# Altium project Guppy Buddy Rev A.PrjPCB (part 7 of 7)

## Sheet 5V Regulator.SchDoc: 5V Regulator
size Tabloid; Date: 1/20/2016; ApprovedBy: NA; CompanyName: Cospan Design LLC; DrawnBy: David McCoy; Engineer: David McCoy; DocumentNumber: 16; Revision: A; SheetNumber: 16; SheetTotal: 18; Client: OSH; ProjectPrettyName: Guppy Buddy; Project: Guppy Buddy; ProjectName: Edenis: TX Adapter
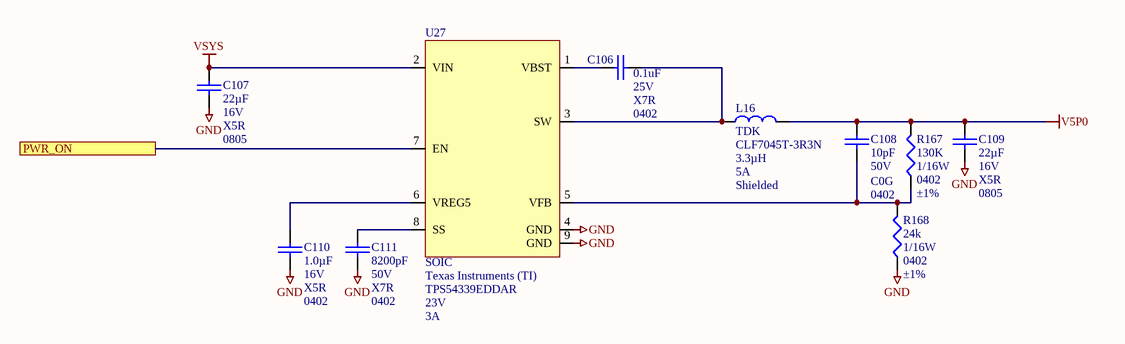
[diagram p14: 5V Regulator.SchDoc]

### Parts
C106  Capacitance: 0.1uF  Voltage - Rated: 25V  Temperature Coefficient: X7R  Package / Case: 0402  [C_0402]  (hidden comment: C_0402_0.1UF_25V)
C107  Voltage - Rated: 16V  Temperature Coefficient: X5R  Package / Case: 0805  [C_0805]  (hidden comment: 22µF)
C108  Voltage - Rated: 50V  Temperature Coefficient: C0G  Package / Case: 0402  [C_0402]  (hidden comment: 10pF)
C109  Voltage - Rated: 16V  Temperature Coefficient: X5R  Package / Case: 0805  [C_0805]  (hidden comment: 22µF)
C110  Capacitance: 1.0µF  Voltage - Rated: 16V  Temperature Coefficient: X5R  Package / Case: 0402  [C_0402]  (hidden comment: 1.0uF)
C111  Capacitance: 8200pF  Voltage - Rated: 50V  Temperature Coefficient: X7R  Package / Case: 0402  [C_ERA-0402]  (hidden comment: C_0402_8.2NF)
L16  Manufacturer: TDK  Manufacturer Part Number: CLF7045T-3R3N  Inductance: 3.3µH  Current Rating: 5A  Shielding: Shielded  [CLF7045]  (hidden comment: L_CLF7045T-3R3N)
R167  Resistance In Ohms: 130K  Power (Watts): 1/16W  Case: 0402  Tolerance: ±1%  [R_0402]  (hidden comment: R_0402_130K)
R168  Resistance In Ohms: 24k  Power (Watts): 1/16W  Case: 0402  Tolerance: ±1%  [R_0402]  (hidden comment: R_0402_24k)
U27  Case/Package: SOIC  Manufacturer: Texas Instruments (TI)  Manufacturer Part Number: TPS54339EDDAR  Max Input Voltage: 23V  Output Current: 3A  [DDA0008E]  (hidden comment: U_TPS54339EDDAR)

### Ports
PWR_ON

### Nets
GND: C107.1 C109.1 C110.1 C111.1 R168.2 U27.4(GND) U27.9(GND)
V5P0: C108.2 C109.2 L16.1 R167.1
VSYS: C107.2 U27.2(VIN)
PWR_ON: U27.7(EN) ; port PWR_ON
NetC106_1: C106.1 L16.2 U27.3(SW)
NetC106_2: C106.2 U27.1(VBST)
NetC108_1: C108.1 R167.2 R168.1 U27.5(VFB)
NetC110_2: C110.2 U27.6(VREG5)
NetC111_2: C111.2 U27.8(SS)

### Notes on the sheet
- Project:
- http://www.cospandesign.com
- Cospan Design
- Document:
- Engineer:
- Title:
- Client:
- Approved By:
- Revision:
- Date:
- Number:
- of

### Library data of the parts
C106 = C_0402_0.1UF_25V: CAP CER 0.1UF 25V X6S 0402; Manufacturer 1: Yageo; Manufacturer Part Number 1: CC0402KRX7R8BB104; Description 1: Cap Ceramic 0.1uF 25V X7R 10% SMD 0402 125C Paper T/R; Tolerance: 10%; Dissipation Factor: 3.5%; ComponentLink1URL: https://product.tdk.com/info/en/catalog/datasheets/mlcc_commercial_general_en.pdf; ComponentLink1Description: https://product.tdk.com/info/en/catalog/datasheets/mlcc_commercial_general_en.pdf; Supplier 1: Digi-Key; Supplier Part Number 1: 311-2077-1-ND; Stock 1: 0; Pricing 1: 1=0.1, 10=0.048, 100=0.0215, 500=0.01534, 1000=0.01205, 2500=0.01095, 5000=0.01007 (USD); Mount: Surface Mount; Case/Package: 0402; Case Code (Imperial): 0402; Case Code (Metric): 1005; Min Operating Temperature: -55°C; Max Operating Temperature: 125°C; Voltage Rating: 25V; Voltage Rating (DC): 25V; Packaging: Tape and Reel; Dielectric: X7R; Termination: SMD/SMT; Composition: Ceramic; Length: 1mm; Height: 0.5mm; Width: 0.02inch; Thickness: 0.022inch; Depth: 0.5mm; Radiation Hardening: No; Lead Free: Lead Free; Halogen Free: Halogen Free; ComponentLink2URL: https://datasheet.ciiva.com/11464/upy-gphc-x7r-6-3v-to-50v-8-11464889.pdf; ComponentLink2Description: https://datasheet.ciiva.com/11464/upy-gphc-x7r-6-3v-to-50v-8-11464889.pdf; ComponentLink3URL: https://datasheet.ciiva.com/13210/upy-gphc-x7r-6-3v-to-50v-8-12304-13210908.pdf; ComponentLink3Description: https://datasheet.ciiva.com/13210/upy-gphc-x7r-6-3v-to-50v-8-12304-13210908.pdf; ComponentLink4URL: https://datasheet.ciiva.com/17437/upy-gphc-x7r-6-3v-to-50v-8-17437357.pdf; ComponentLink4Description: https://datasheet.ciiva.com/17437/upy-gphc-x7r-6-3v-to-50v-8-17437357.pdf
C107 C109 = C_0805_22µF_16V: CAP CER 22UF 16V 10% X5R 0805; Manufacturer 1: Samsung; Manufacturer Part Number 1: CL21A226MOCLRNC; Description 1: 22µF 16V Ceramic Capacitor X5R 0805 (2012 Metric) 0.079" L x 0.049" W (2.00mm x 1.25mm); Tolerance: 20%; ComponentLink1URL: http://product.tdk.com/capacitor/mlcc/en/documents/mlcc_commercial_general_en.pdf; ComponentLink1Description: http://product.tdk.com/capacitor/mlcc/en/documents/mlcc_commercial_general_en.pdf; Supplier 1: Digi-Key; Supplier Part Number 1: 1276-6780-6-ND; Stock 1: 40000; Pricing 1: 1=0.33, 10=0.227, 100=0.1288, 500=0.09094, 1000=0.07956 (USD); Mount: Surface Mount; Case/Package: 0805; Case Code (Metric): 2012; Case Code (Imperial): 0805; Min Operating Temperature: -55°C; Max Operating Temperature: 85°C; Packaging: Tape and Reel; Voltage Rating: 16V; Length: 0.079inch; Width: 0.049inch; Thickness: 0.037inch; ComponentLink2URL: http://www.samsungsem.com/kr/support/product-search/mlcc/CL21A226MOCLRNC.jsp; ComponentLink2Description: http://www.samsungsem.com/kr/support/product-search/mlcc/CL21A226MOCLRNC.jsp; Capacitance: 22µF
C108 = C_0402_10PF_50V: CAP CER 10PF 50V NP0 0402; Manufacturer: Taiyo Yuden; Manufacturer Part Number: UMK105CG100DV-F; Tolerance: .5pF; Supplier 1: Digi-Key; Supplier Part Number 1: 587-1947-1-ND; RoHS: RoHS Compliant; Category: Capacitors; Stock 1: 47289; Pricing: 1=0.07, 10=0.045, 50=0.0216, 100=0.0162, 250=0.01172, 500=0.00864, 1000=0.00585, 5000=0.0045 (USD); Mounting Type: Surface Mount, MLCC; Operating Temperature: -55°C ~ 125°C; Applications: General Purpose; Ratings: -; Size / Dimension: 0.039" L x 0.020" W (1.00mm x 0.50mm); Height - Seated (Max): -; Thickness (Max): 0.022" (0.55mm); Lead Spacing: -; Features: -; Packaging: Cut Tape (CT); Lead Style: -; ComponentLink1URL: http://www.yuden.co.jp/productdata/catalog/en/mlcc02_e.pdf; ComponentLink1Description: http://www.yuden.co.jp/productdata/catalog/en/mlcc02_e.pdf; Capacitance: 10pF
C110 = C_0402_1.0UF_16V: CAP CER 1.0UF 16V X5R 0402; Manufacturer 1: Samsung; Manufacturer Part Number 1: CL05A105KO5NNNC; Tolerance: 10%; Description 1: Cap Ceramic 1uF 16V X5R 10% SMD 0402 85C Paper T/R; Supplier 1: Digi-Key; Stock 1: 26908; Pricing 1: 1=0.1, 10=0.062, 100=0.0276, 500=0.01968, 1000=0.01547, 2500=0.01406, 5000=0.01294 (USD); Packaging: Tape and Reel; ComponentLink1URL: http://ds.yuden.co.jp/TYCOMPAS/ut/detail.do?productNo=EMK105BJ105KV-F&fileName=EMK105BJ105KV-F_SS&mode=specSheetDownload; ComponentLink1Description: http://ds.yuden.co.jp/TYCOMPAS/ut/detail.do?productNo=EMK105BJ105KV-F&fileName=EMK105BJ105KV-F_SS&mode=specSheetDownload; Supplier Part Number 1: 1276-1067-6-ND; ComponentLink2URL: https://datasheet.ciiva.com/16207/cl05a105ko5nnnc-16207571.pdf; ComponentLink2Description: https://datasheet.ciiva.com/16207/cl05a105ko5nnnc-16207571.pdf; ComponentLink3URL: https://datasheet.ciiva.com/15195/getdatasheetpartid-355272-15195629.pdf; ComponentLink3Description: https://datasheet.ciiva.com/15195/getdatasheetpartid-355272-15195629.pdf; Mount: Surface Mount; Case/Package: 0402; Case Code (Metric): 1005; Case Code (Imperial): 0402; Contact Plating: Tin; Min Operating Temperature: -55°C; Max Operating Temperature: 85°C; Dielectric: X5R; Package Quantity: 1; Voltage Rating: 16V; Voltage: 16V; Length: 1mm; Height: 0.5mm; Width: 0.02inch; Thickness: 0.022inch; Depth: 0.5mm; Radiation Hardening: No
C111 = C_0402_8.2NF: CAP CER 8200PF 50V X7R 0402; Manufacturer 1: Samsung; Manufacturer Part Number 1: CL05B822KB5NNNC; Tolerance: 10%; Description 1: Cap Ceramic 0.0082uF 50V X7R 10% SMD 0402 125C T/R; Material: Ceramic; Supplier 1: Digi-Key; Stock 1: 102323; Pricing 1: 1=0.1, 10=0.037, 100=0.0164, 500=0.01168, 1000=0.00918, 2500=0.00834, 5000=0.00768 (USD); Packaging: Tape and Reel; ComponentLink1URL: http://www.murata.com/~/media/webrenewal/support/library/catalog/products/capacitor/mlcc/c02e.ashx; ComponentLink1Description: http://www.murata.com/~/media/webrenewal/support/library/catalog/products/capacitor/mlcc/c02e.ashx; Supplier Part Number 1: 1276-1591-6-ND; Mount: Surface Mount; Case/Package: 0402; Case Code (Metric): 1005; Case Code (Imperial): 0402; Min Operating Temperature: -55°C; Max Operating Temperature: 125°C; Package Quantity: 1; Voltage Rating: 50V; Dielectric: X7R; Voltage: 50V; Voltage Rating (DC): 50V; Length: 1mm; Height: 0.5mm; Width: 0.02inch; Thickness: 0.022inch; Depth: 0.5mm; Radiation Hardening: No; Lead Free: Lead Free; ComponentLink2URL: https://datasheet.ciiva.com/16207/cl05b104kq5nnnc-16207576.pdf; ComponentLink2Description: https://datasheet.ciiva.com/16207/cl05b104kq5nnnc-16207576.pdf; ComponentLink3URL: https://datasheet.ciiva.com/15195/getdatasheetpartid-464695-15195658.pdf; ComponentLink3Description: https://datasheet.ciiva.com/15195/getdatasheetpartid-464695-15195658.pdf; ComponentLink4URL: https://datasheet.ciiva.com/29198/458804-da-01-en-vs-kondensator-0402-29198438.pdf; ComponentLink4Description: https://datasheet.ciiva.com/29198/458804-da-01-en-vs-kondensator-0402-29198438.pdf
L16 = L_CLF7045T-3R3N: FIXED IND 15UH 1.9A 95.8 MOHM; Type: Wirewound; Material - Core: Ferrite; Tolerance: ±30%; DC Resistance (DCR): 21.32 mOhm Max; Supplier 1: Digi-Key; RoHS: RoHS Compliant; Category: Inductors, Coils, Chokes; Stock 1: 4747; Pricing 1: 1=1.43, 10=1.332, 100=0.9632, 500=0.73774 (USD); Packaging: Cut Tape (CT); Part Status: Active; Q @ Freq: -; Ratings: AEC-Q200; Operating Temperature: -40°C ~ 150°C; Mounting Type: Surface Mount; Package / Case: Nonstandard; Size / Dimension: 0.283" L x 0.272" W (7.20mm x 6.90mm); Height - Seated (Max): 0.177" (4.50mm); ComponentLink1URL: https://product.tdk.com/info/en/documents/catalog/inductor_automotive_power_clf7045-d_en.pdf; ComponentLink1Description: https://product.tdk.com/info/en/documents/catalog/inductor_automotive_power_clf7045-d_en.pdf; Supplier Part Number 1: 445-9554-1-ND
R167 = R_0402_130K: RES 130K OHM 1/10W 1% 0402 SMD; Manufacturer: Panasonic Electronic Components; Manufacturer Part Number: ERJ-2RKF1303X; Temperature Coefficient: ±100ppm/°C; Supplier 1: Digi-Key; Supplier Part Number 1: P130KLCT-ND; RoHS: RoHS Compliant; Category: Resistors; Stock 1: 388696; Pricing: 1=0.1, 50=0.0242, 100=0.0184, 250=0.01364, 500=0.01008, 1000=0.00672, 5000=0.00473 (USD); Resistance (Ohms): 130k; Composition: Thick Film; Features: -; Package / Case: 0402 (1005 Metric); Supplier Device Package: 0402; Size / Dimension: 0.039" L x 0.020" W (1.00mm x 0.50mm); Height: 0.016" (0.40mm); Number of Terminations: 2; Packaging: Cut Tape (CT); ComponentLink1URL: http://industrial.panasonic.com/www-cgi/jvcr13pz.cgi?E+PZ+3+AOA0002+ERJ2RKF1303X+7+WW; ComponentLink1Description: http://industrial.panasonic.com/www-cgi/jvcr13pz.cgi?E+PZ+3+AOA0002+ERJ2RKF1303X+7+WW
R168 = R_0402_24k: RES SMD 24K OHM 1% 1/16W 0402; Manufacturer: Yageo; Manufacturer Part Number: RC0402FR-0724KL; Temperature Coefficient: ±100ppm/°C; Supplier 1: Digi-Key; RoHS: RoHS Compliant; Category: Resistors; Stock 1: 267958; Pricing 1: 1=0.1, 10=0.014, 100=0.0056, 1000=0.00253, 2500=0.0022, 5000=0.00181 (USD); Packaging: Cut Tape (CT); Part Status: Active; Resistance (Ohms): 24k; Composition: Thick Film; Features: Moisture Resistant; Operating Temperature: -55°C ~ 155°C; Package / Case: 0402 (1005 Metric); Supplier Device Package: 0402; Size / Dimension: 0.039" L x 0.020" W (1.00mm x 0.50mm); Height - Seated (Max): 0.016" (0.40mm); Failure Rate: -; ComponentLink1URL: http://www.yageo.com/documents/recent/PYu-RC_Group_51_RoHS_L_7.pdf; ComponentLink1Description: http://www.yageo.com/documents/recent/PYu-RC_Group_51_RoHS_L_7.pdf; Supplier Part Number 1: 311-24KLRCT-ND
U27 = U_TPS54339EDDAR: IC REG BUCK SYNC ADJ 3A 8SOPWR; Min Supply Voltage: 4.5V; Number of Outputs: 1; Output Voltage: 7V; Max Output Current: 10A; Switching Frequency: 600KHz; Min Output Voltage: 760mV; Synchronous Rectifier: Yes; Quiescent Current: 600uA; Supplier 1: Digikey; Stock 1: 1978; Pricing 1: 1=1.91, 10=1.72, 100=1.3822, 500=1.1356, 1000=0.9409 (USD); Mount: Surface Mount; Number of Pins: 8; Contact Plating: Gold; Min Operating Temperature: -40°C; Max Operating Temperature: 85°C; Min Input Voltage: 4.5V; Package Quantity: 2500; Packaging: Tape and Reel; Max Output Voltage: 7V; Lead Free: Lead Free; ComponentLink1URL: http://www.ti.com/litv/slvsbm0a; ComponentLink1Description: http://www.ti.com/litv/slvsbm0a; ComponentLink2URL: http://www.ti.com/general/docs/lit/getliterature.tsp?genericPartNumber=TPS54339E&&fileType=pdf; ComponentLink2Description: http://www.ti.com/general/docs/lit/getliterature.tsp?genericPartNumber=TPS54339E&&fileType=pdf; ComponentLink3URL: http://www.ti.com/lit/ds/symlink/tps54339e.pdf; ComponentLink3Description: http://www.ti.com/lit/ds/symlink/tps54339e.pdf; Supplier Part Number 1: 296-40793-1-ND

## Sheet Low Speed Expansion.SchDoc: Low Speed Expansion
size Tabloid; ApprovedBy: NA; CompanyName: Cospan Design LLC; DrawnBy: David McCoy; Engineer: David McCoy; DocumentNumber: 9; Revision: A; SheetNumber: 9; SheetTotal: 18; Client: OSH; Project: Guppy Buddy; ProjectPrettyName: Guppy Buddy
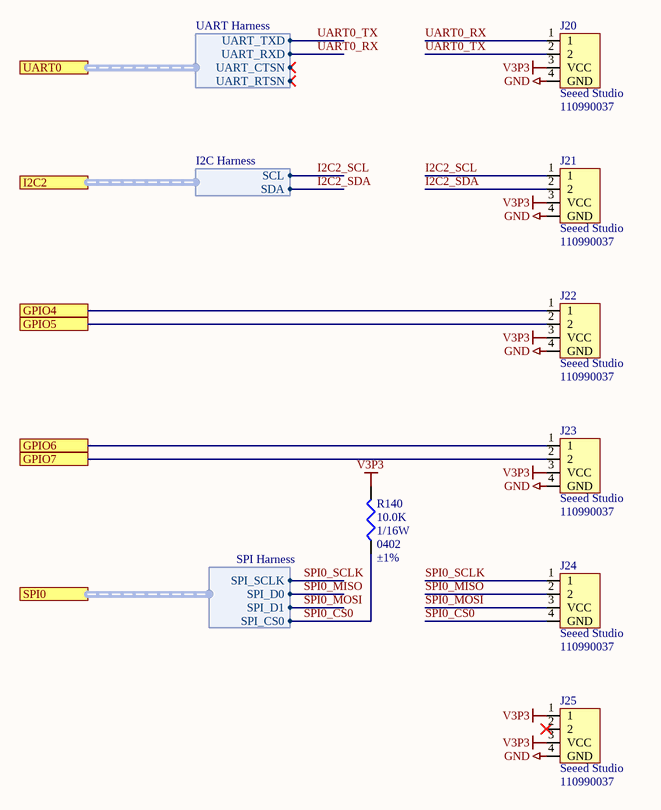
[diagram p15: Low Speed Expansion.SchDoc]

### Parts
J20  Manufacturer 1: Seeed Studio  Manufacturer Part Number 1: 110990037  [HW4-2.0-90D]  (hidden comment: 320110034)
J21  Manufacturer 1: Seeed Studio  Manufacturer Part Number 1: 110990037  [HW4-2.0-90D]  (hidden comment: 320110034)
J22  Manufacturer 1: Seeed Studio  Manufacturer Part Number 1: 110990037  [HW4-2.0-90D]  (hidden comment: 320110034)
J23  Manufacturer 1: Seeed Studio  Manufacturer Part Number 1: 110990037  [HW4-2.0-90D]  (hidden comment: 320110034)
J24  Manufacturer 1: Seeed Studio  Manufacturer Part Number 1: 110990037  [HW4-2.0-90D]  (hidden comment: 320110034)
J25  Manufacturer 1: Seeed Studio  Manufacturer Part Number 1: 110990037  [HW4-2.0-90D]  (hidden comment: 320110034)
R140  Resistance In Ohms: 10.0K  Power (Watts): 1/16W  Case: 0402  Tolerance: ±1%  [R_0402]  (hidden comment: R_0402_10.0K)

### Ports
GPIO4, GPIO5, GPIO6, GPIO7, I2C2 (harness I2C Harness), SPI0 (harness SPI Harness), UART0 (harness UART Harness)

### Harnesses
UART Harness: UART_TXD, UART_RXD, UART_CTSN, UART_RTSN
I2C Harness: SCL, SDA
SPI Harness: SPI_SCLK, SPI_D0, SPI_D1, SPI_CS0

### Nets
GND: J20.4(GND) J21.4(GND) J22.4(GND) J23.4(GND) J25.4(GND)
V3P3: J20.3(VCC) J21.3(VCC) J22.3(VCC) J23.3(VCC) J25.1 J25.3(VCC) R140.1
I2C2_SCL: J21.1 ; port I2C2.SCL
I2C2_SDA: J21.2 ; port I2C2.SDA
SPI0_CS0: J24.4(GND) R140.2 ; port SPI0.SPI_CS0
SPI0_MISO: J24.2 ; port SPI0.SPI_D0
SPI0_MOSI: J24.3(VCC) ; port SPI0.SPI_D1
SPI0_SCLK: J24.1 ; port SPI0.SPI_SCLK
UART0_RX: J20.1 ; port UART0.UART_RXD
UART0_TX: J20.2 ; port UART0.UART_TXD
NetJ22_1: J22.1 ; port GPIO4
NetJ22_2: J22.2 ; port GPIO5
NetJ23_1: J23.1 ; port GPIO6
NetJ23_2: J23.2 ; port GPIO7

Not connected (* = marked no-connect by the designer): J25 2*

### Notes on the sheet
- Project:
- http://www.cospandesign.com
- Cospan Design
- Document:
- Engineer:
- Title:
- Client:
- Approved By:
- Revision:
- Date:
- Number:
- of

### Library data of the parts
J20-J25 = J_GROVE-CONNECTOR-DIP-90D(4P-2.0): SymbolName_1: GROVE-CONNECTOR-DIP; LibraryName: Seeed-Connector -2016; Package: HW4-2.0-90D; Supplier 1: Digi-Key; Supplier Part Number 1: 1597-1083-ND; Stock 1: 714; Pricing 1: 1=1.53 (USD); ComponentLink1URL: http://www.seeedstudio.com/document/pdf/Preface.pdf; ComponentLink1Description: http://www.seeedstudio.com/document/pdf/Preface.pdf; ComponentLink2URL: http://www.mouser.com/ds/2/744/Seeed_316010005-786598.pdf; ComponentLink2Description: http://www.mouser.com/ds/2/744/Seeed_316010005-786598.pdf
R140 = R_0402_10.0K: RES 10.0K OHM 1/16W 1% 0402 SMD; Manufacturer: Stackpole Electronics Inc; Manufacturer Part Number: RMCF0402FT10K0; Resistance (Ohms): 10k; Temperature Coefficient: ±100ppm/°C; Supplier 1: Digi-Key; Supplier Part Number 1: RMCF0402FT10K0CT-ND; RoHS: RoHS Compliant; Category: Resistors; Stock 1: 234525; Pricing: 1=0.04, 10=0.025, 50=0.0138, 100=0.0105, 250=0.0078, 500=0.00576, 1000=0.00384, 2500=0.00324, 5000=0.0027 (USD); Composition: Thick Film; Features: -; Package / Case: 0402 (1005 Metric); Size / Dimension: 0.039" L x 0.020" W (1.00mm x 0.50mm); Height: 0.016" (0.40mm); Number of Terminations: 2; Packaging: Cut Tape (CT); ComponentLink1URL: http://www.seielect.com/Catalog/SEI-RMCF_RMCP.pdf; ComponentLink1Description: http://www.seielect.com/Catalog/SEI-RMCF_RMCP.pdf

## Nets that join several sheets
GND: Battery Manager (11 pins), USB Type C (31 pins), USB Type C Connector ESD (19 pins), SOM Power (42 pins), SOM Analog USB (U2.N13), User Interface (46 pins), WIFI Bluetooth (84 pins), SDCard (C45.1 C46.1 J5.6 J5.9), LCD (22 pins), Cart (7 pins), Audio Codec (22 pins), 1.8V Regulator (C31.1 C57.1 U12.1), 3.3V Regulator (7 pins), 5V Regulator (7 pins), Low Speed Expansion (5 pins)
SYS_VDD1_3P3V: SOM Power (7 pins), SDCard (10 pins)
USB_3V3: USB Type C (19 pins), USB Type C Connector ESD (C125.2 LED14.1 U30.10)
V1P8: User Interface (C85.2 C87.2 J16.2 J17.2), WIFI Bluetooth (13 pins), Cart (6 pins), Audio Codec (C71.2 C72.2 U15.21), 1.8V Regulator (C57.2 U12.2)
V3P3: USB Type C (LED1.1 LED4.1), SOM Power (R49.1 R50.1), User Interface (10 pins), WIFI Bluetooth (5 pins), LCD (J11.1 L8.2 R104.1), Cart (6 pins), Audio Codec (7 pins), 3.3V Regulator (C105.2 L9.2 R165.1 U17.5), Low Speed Expansion (7 pins)
V5P0: SOM Power (T5.1 U2.P10 U2.R10 U2.T10), SOM Analog USB (U2.M15), LCD (C47.2 C48.2 L7.1 U13.5), Cart (J6.1), Audio Codec (C79.2 C80.2 U15.18), 1.8V Regulator (C31.2 U12.3), 3.3V Regulator (C103.2 C104.2 U17.1 U17.8), 5V Regulator (C108.2 C109.2 L16.1 R167.1)
V_USB_HV: Battery Manager (8 pins), USB Type C (C88.2 C89.2 U14.33 U14.34)
VBUS: USB Type C (L4.1), USB Type C Connector ESD (9 pins)
VSYS: Battery Manager (10 pins), 5V Regulator (C107.2 U27.2)
C_CC1: USB Type C (C97.2 R116.2 U14.13), USB Type C Connector ESD (U30.12)
C_CC2: USB Type C (C28.2 R120.2 U14.15), USB Type C Connector ESD (U30.11)
C_USB_B_N: USB Type C (U14.9), USB Type C Connector ESD (J12.B7 U30.16)
C_USB_B_P: USB Type C (U14.8), USB Type C Connector ESD (J12.B6 U30.17)
C_USB_T_N: USB Type C (U14.7), USB Type C Connector ESD (J12.A7 U30.19)
C_USB_T_P: USB Type C (U14.6), USB Type C Connector ESD (J12.A6 U30.20)
S_SBU_N: USB Type C (R158.2 R162.1 U14.11), USB Type C Connector ESD (U30.14)
S_SBU_P: USB Type C (R157.2 R161.1 U14.10), USB Type C Connector ESD (U30.15)

## Assembly variants
Main Build: not fitted J1 J4 J6 J7 J9 J13 J18 J28 L2 L3 L5 L6 R52 R56 R57 R104 R105 R136 S2